# EasyEDA Pro project STM32_sniffer.eprj

# Schematic sniffer

## Sheets
1 MCU: Board Name: sniffer; Create Date: 2025-06-11; Page Name: MCU; Project Name: STM32_sniffer; Schematic Name: sniffer; Update Date: 2025-07-09; Company: 嘉立创EDA; Page Size: A4; Version: V1.0
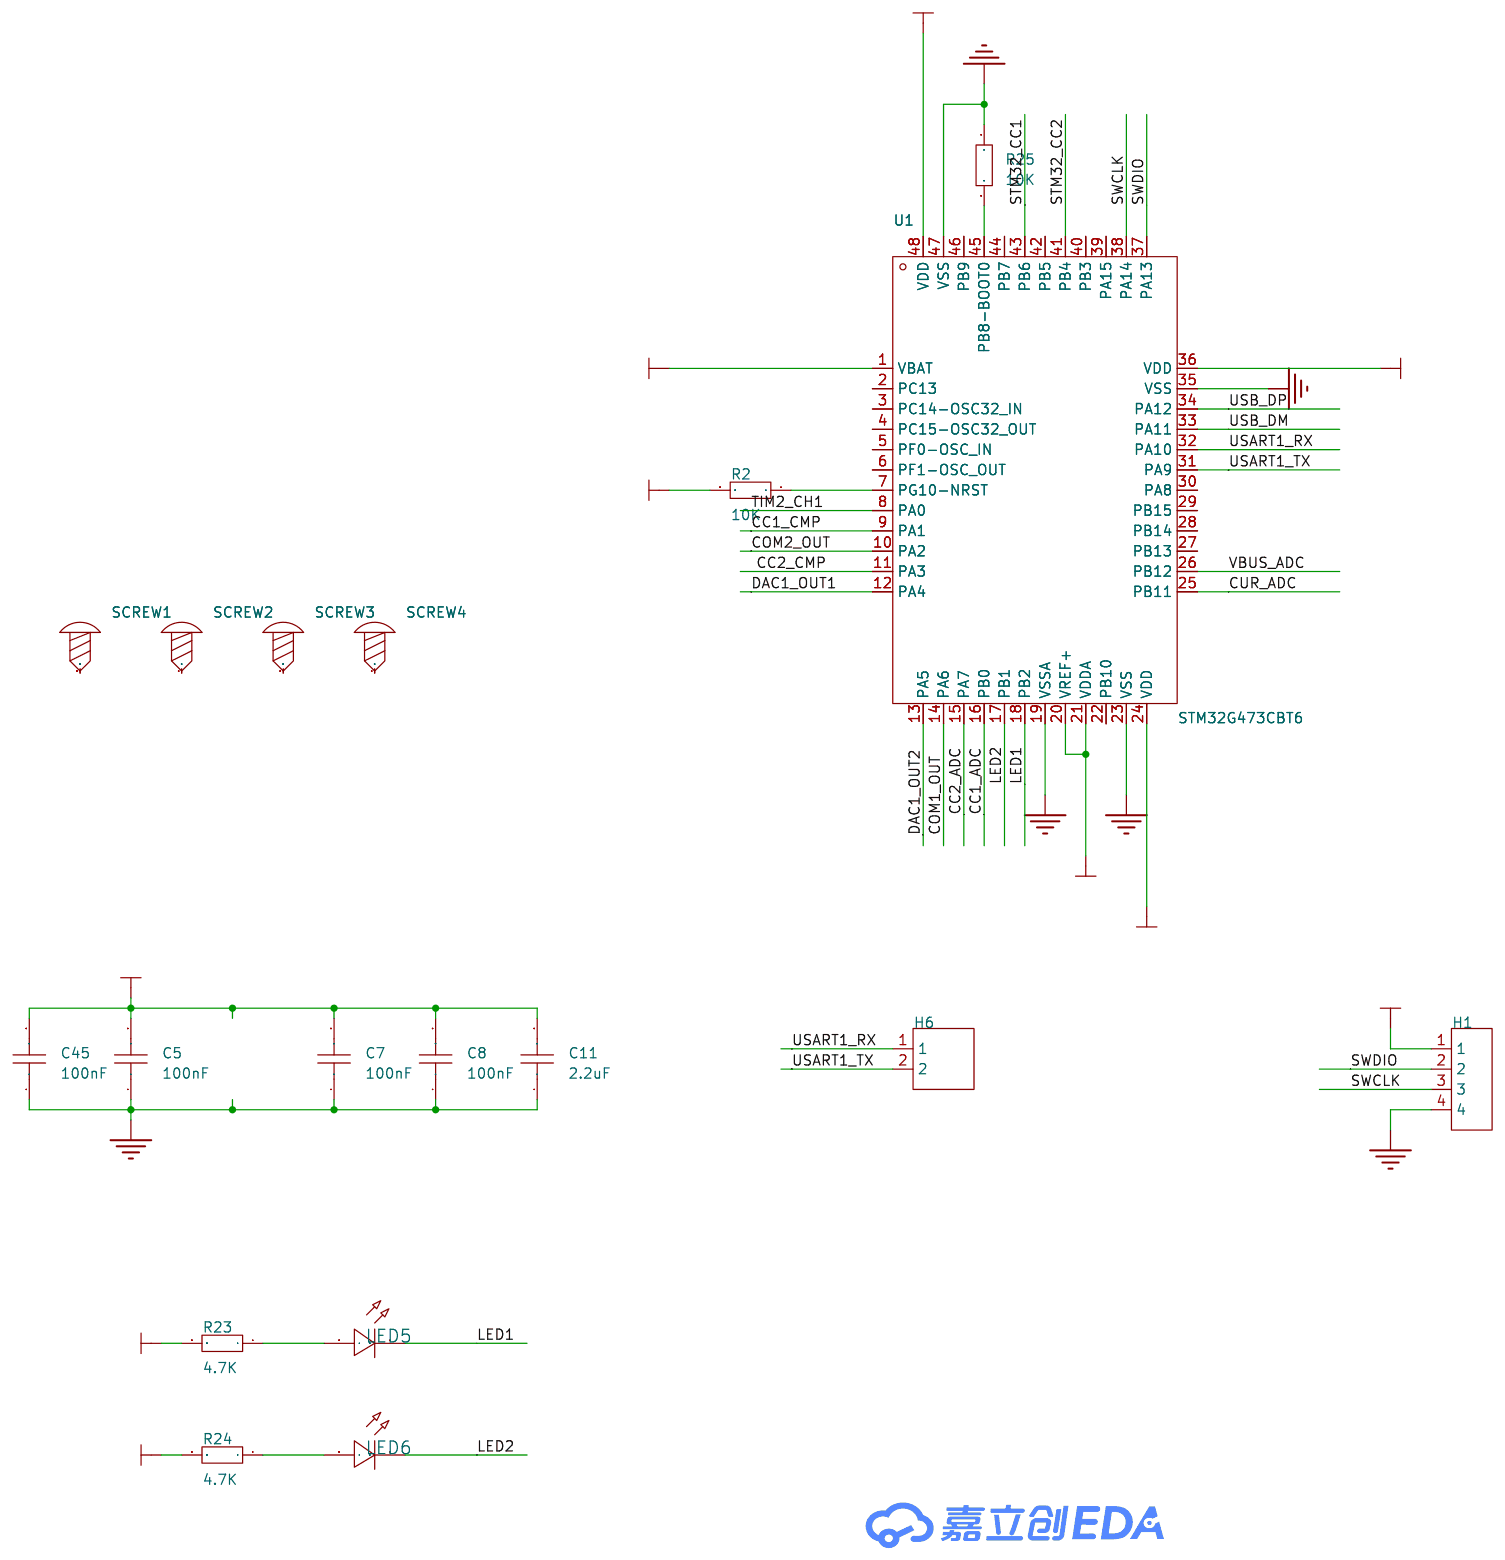
[diagram p0: MCU]
2 power: Page Name: power; Update Date: 2025-06-11
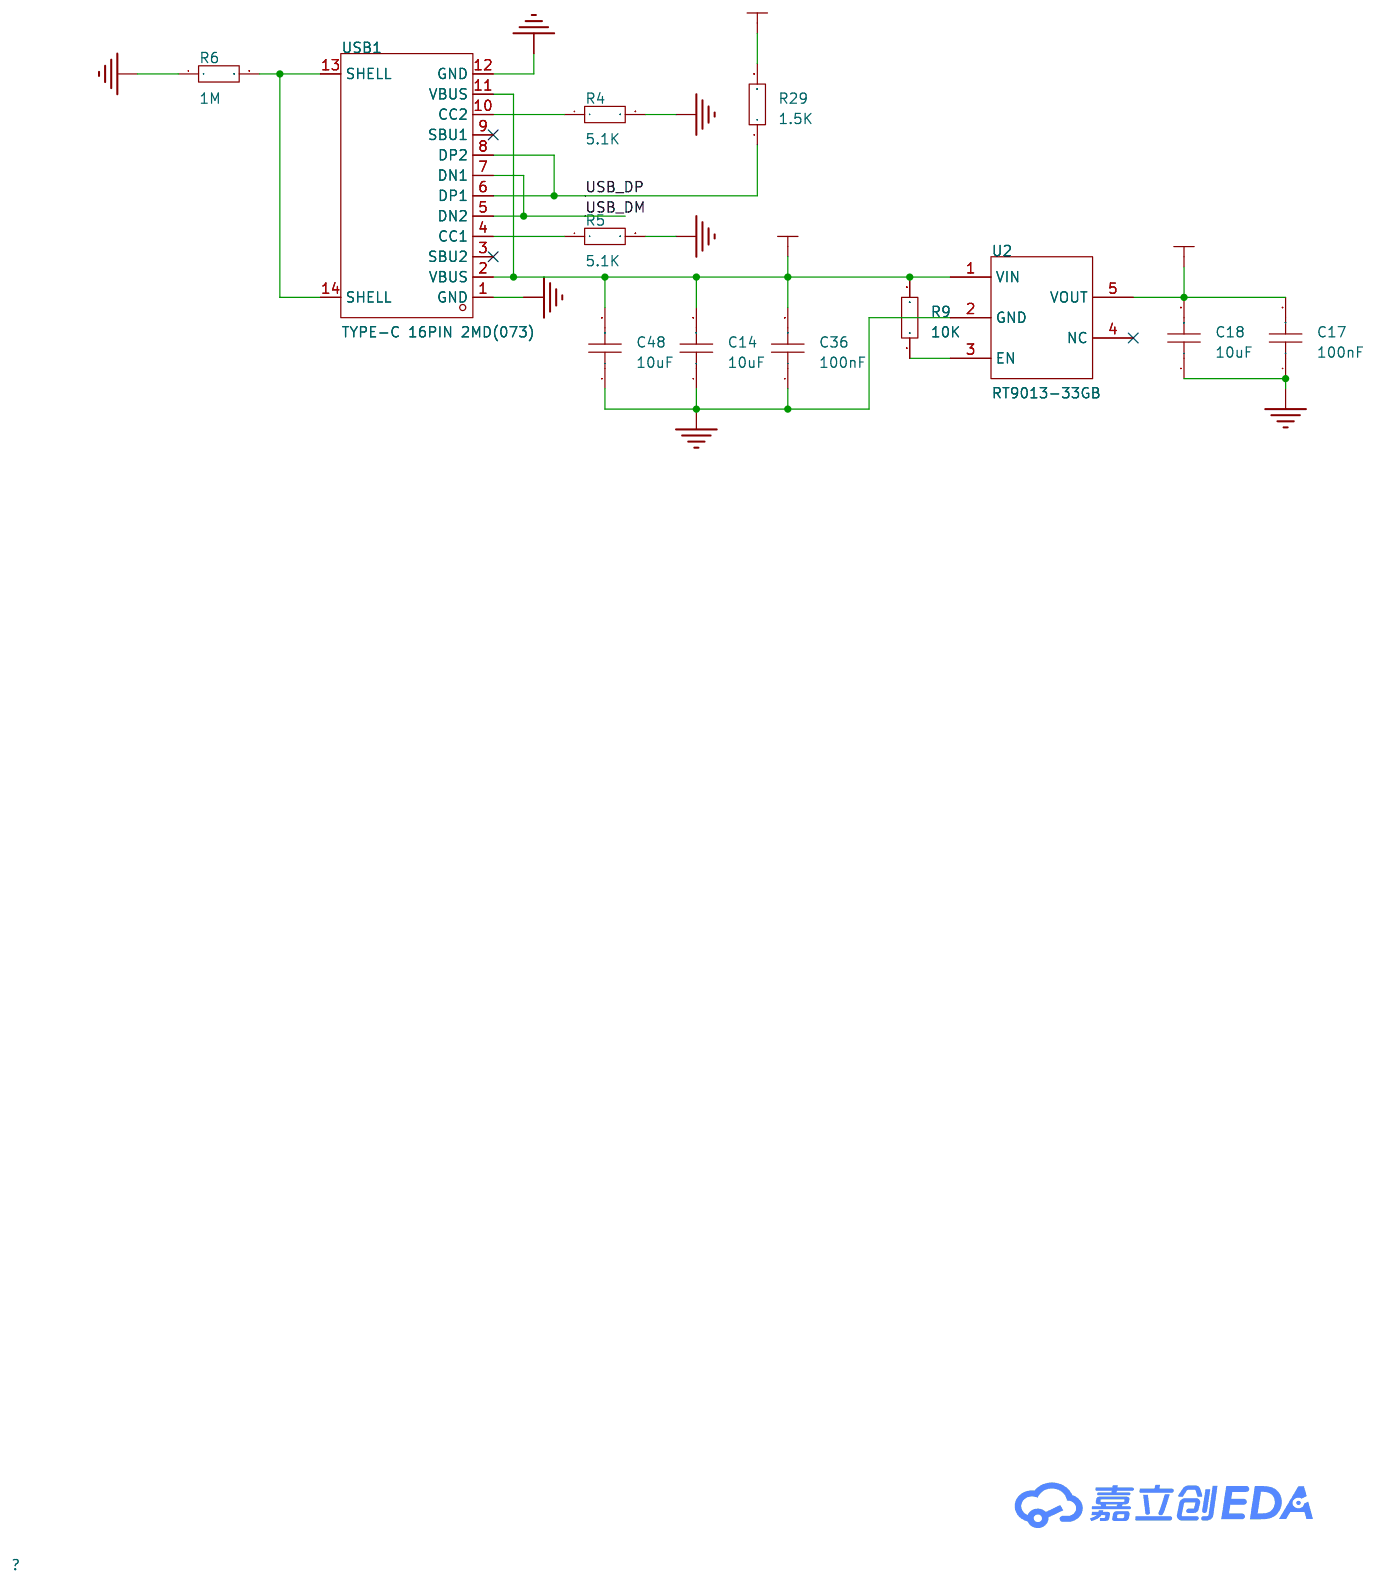
[diagram p1: power]
3 comp: Page Name: comp; Update Date: 2025-07-02
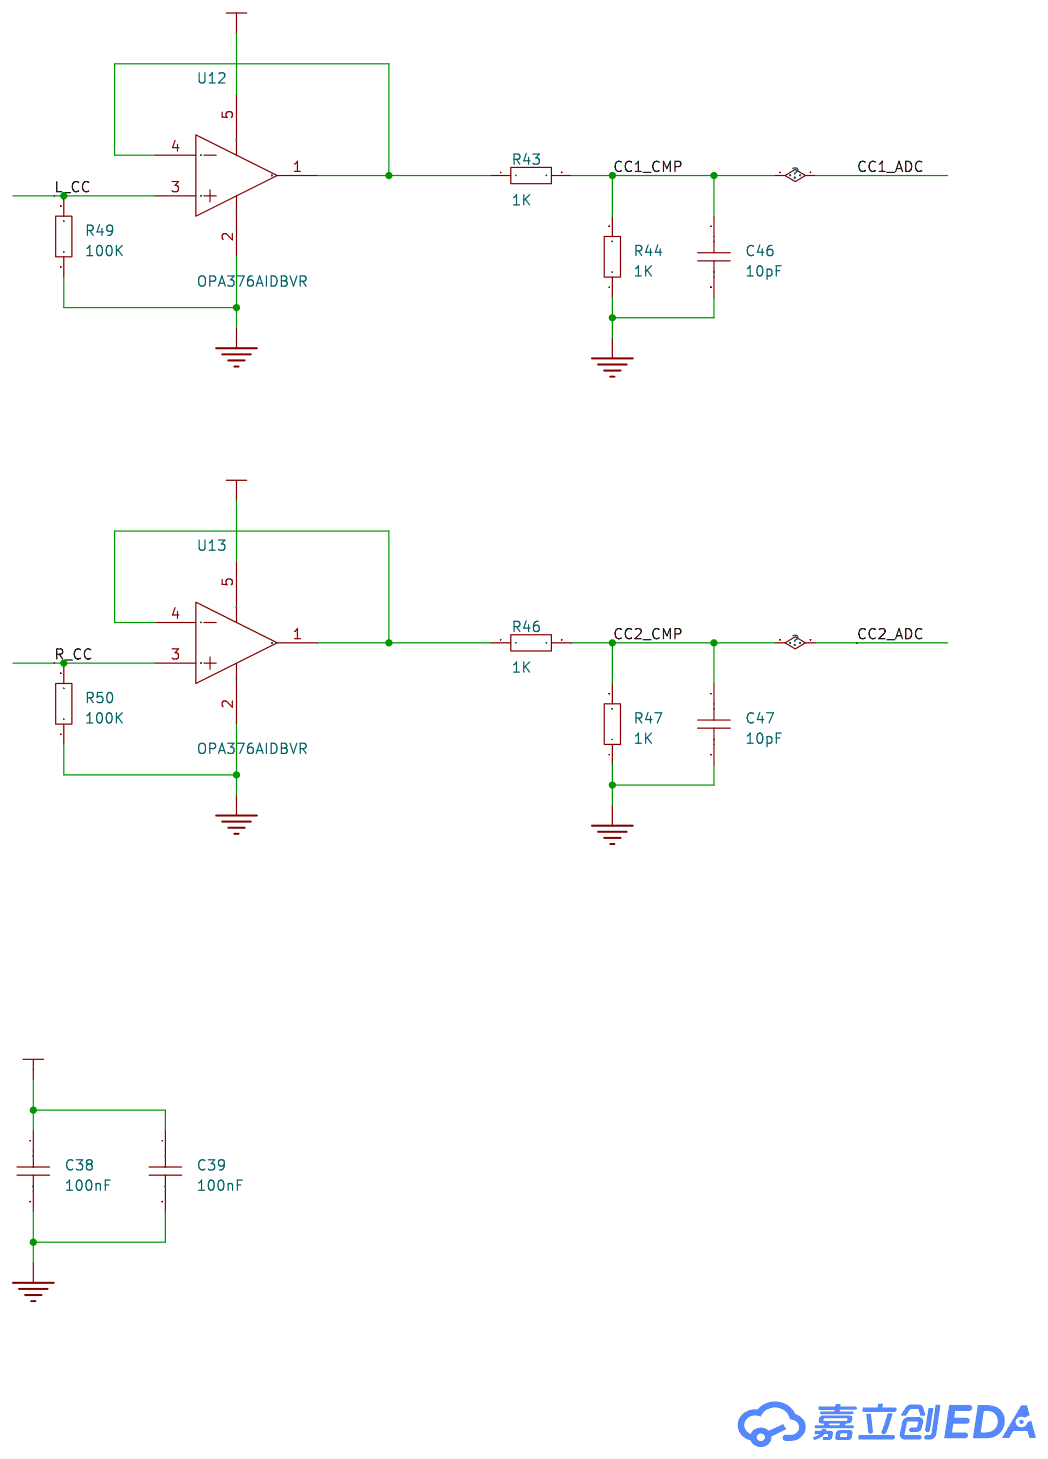
[diagram p2: comp]
4 typec: Page Name: typec
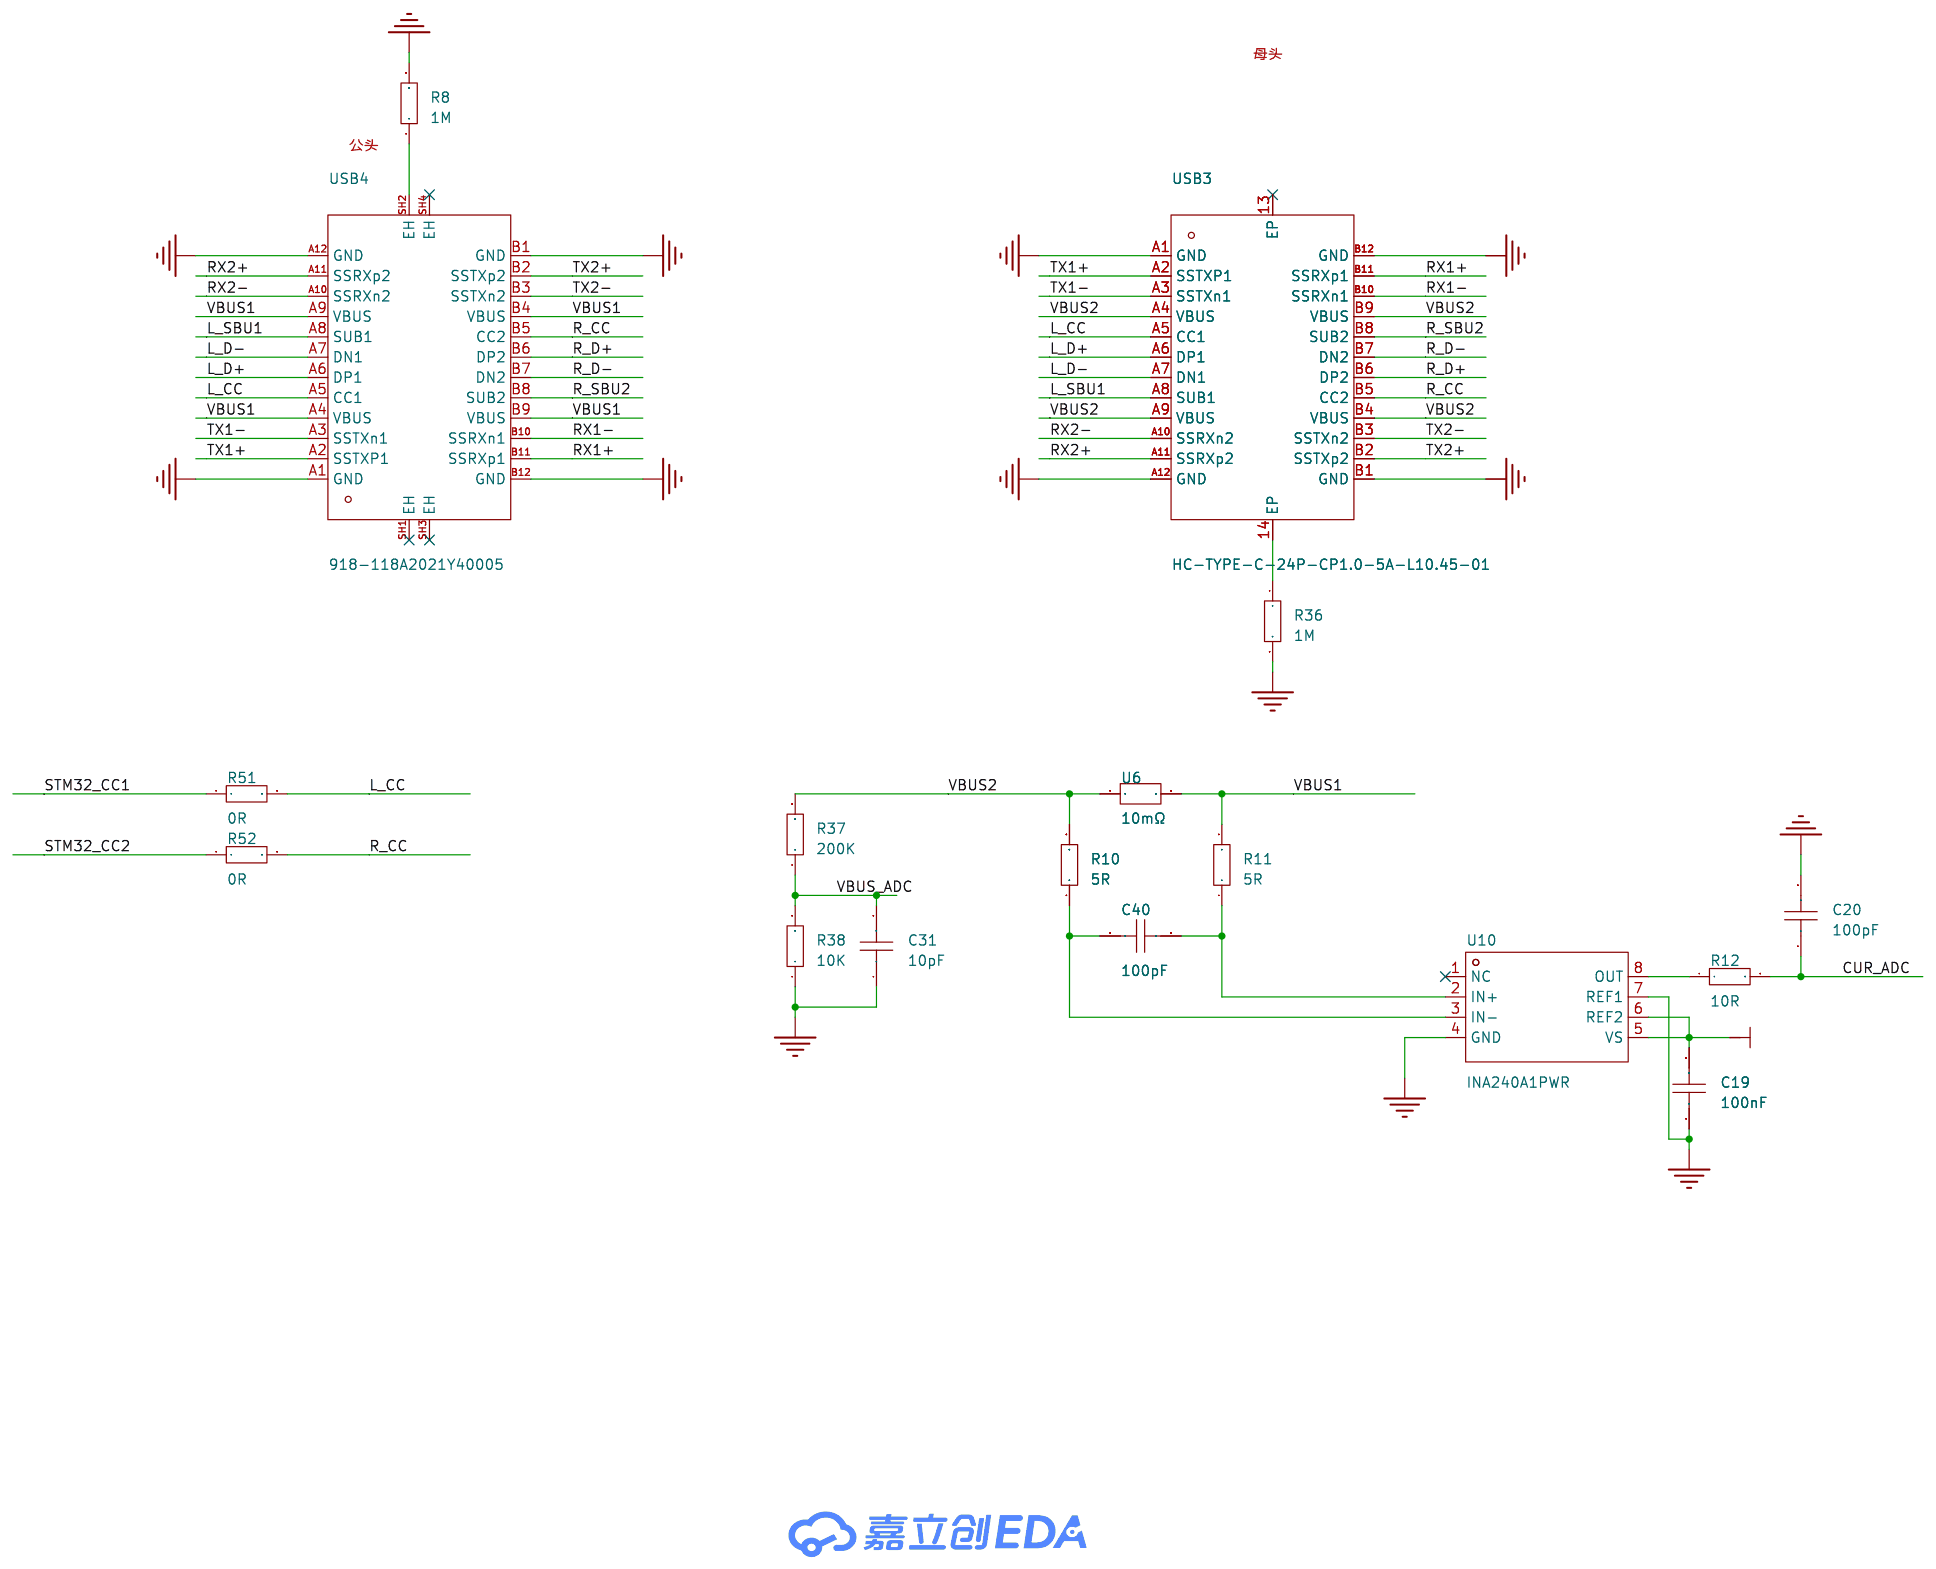
[diagram p3: typec]

## Parts
sheet comp
C38  100nF  [C0603]
C39  100nF  [C0603]
C46  10pF  [C0603]
C47  10pF  [C0603]
R43  1K  [R0603]
R44  1K  [R0603]
R46  1K  [R0603]
R47  1K  [R0603]
R49  100K  [R0603]
R50  100K  [R0603]
U12  OPA376AIDBVR  [SOT-23-5_L3.0-W1.7-P0.95-LS2.8-BR]
U13  OPA376AIDBVR  [SOT-23-5_L3.0-W1.7-P0.95-LS2.8-BR]
sheet MCU
C5  100nF  [C0603]
C7  100nF  [C0603]
C8  100nF  [C0603]
C11  2.2uF  [C0603]
C45  100nF  [C0603]
H1  -  [HDR-TH_4P-P2.54-V-M]
H6  -  [HDR-TH_2P-P2.54-V-M-1]
LED5  -  [LED_0805]
LED6  -  [LED_0805]
R2  10K  [R0603]
R23  4.7K  [R0603]
R24  4.7K  [R0603]
R25  10K  [R0603]
SCREW1  -  [M2螺丝]
SCREW2  -  [M2螺丝]
SCREW3  -  [M2螺丝]
SCREW4  -  [M2螺丝]
U1  STM32G473CBT6  [LQFP-48_L7.0-W7.0-P0.50-LS9.0-BL]
sheet power
C14  10uF  [C0805]
C17  100nF  [C0603]
C18  10uF  [C0603]
C36  100nF  [C0805]
C48  10uF  [C0805]
R4  5.1K  [R0603]
R5  5.1K  [R0603]
R6  1M  [R0603]
R9  10K  [R0603]
R29  1.5K  [R0603]
U2  RT9013-33GB  [SOT-23-5_L3.0-W1.7-P0.95-LS2.8-BL]
USB1  TYPE-C 16PIN 2MD(073)  [USB-C-SMD_TYPE-C-6PIN-2MD-073]
sheet typec
C19  100nF  [C0603]
C20  100pF  [C0603]
C31  10pF  [C0603]
C40  100pF  [C0603]
R8  1M  [R0603]
R10  5R  [R0603]
R11  5R  [R0603]
R12  10R  [R0603]
R36  1M  [R0603]
R37  200K  [R0603]
R38  10K  [R0603]
R51  0R  [R0603]
R52  0R  [R0603]
U6  10mΩ  [R1206]
U10  INA240A1PWR  [TSSOP-8_L4.4-W3.0-P0.65-LS6.4-BL]
USB3  HC-TYPE-C-24P-CP1.0-5A-L10.45-01  [USB-SMD_HC-TYPE-C-24P-CP1.0-5A-L10.45-01]
USB4  918-118A2021Y40005  [USB-C-SMD_918-118A2021Y40005]

## Library data of the parts
C5 C7 C8 C11 C17-C20 C31 C38-C40 C45-C47 = CAP_0603: Supplier Footprint: 0603
R2 R4-R6 R8-R12 R23-R25 R29 R36-R38 R43 R44 R46 R47 R49-R52 = Res_0603: Supplier Footprint: 0603
U12 U13 = OPA376AIDBVR: Supplier Part: C42134; Manufacturer: TI(德州仪器); Supplier Footprint: SOT-23-5; JLCPCB Part Class: 扩展库; Datasheet: https://www.ti.com/cn/lit/gpn/opa376; Supplier: LCSC; Number of Circuits: 单路; Gain Bandwidth Product(GBP): 5.5MHz; Current - Input Bias(Ib): 0.2pA; Slew Rate(SR): 2V/us; Output Current: 50mA; Supply Current: 760uA; Operating Temperature: -40℃~+125℃
H1 = HDR-M_2.54_1x4P: Supplier Part: C492403; Supplier Footprint: 插件
H6 = HDR-M_2.54_1x2P: Supplier Part: C124375; Supplier Footprint: 插件
LED5 LED6 = LED_0805-R: Supplier Footprint: 0805
SCREW1-SCREW4 = M2螺丝: Supplier Footprint: 插件
U1 = STM32G473CBT6: LCSC Part Name: 带DSP和FPU的170MHz主流ARM Cortex-M4 MCU，具有128 KB Flash存储器、数学加速器和高模拟电平集成; Supplier Part: C730111; Manufacturer: ST(意法半导体); Supplier Footprint: LQFP-48(7x7); JLCPCB Part Class: 扩展库; Datasheet: https://atta.szlcsc.com/upload/public/pdf/source/20200902/C730111_19331807E2800E1C1C13BFFAAC550E20.pdf; Supplier: LCSC
C14 C36 C48 = CAP_0805: Supplier Footprint: 0805
U2 = RT9013-33GB: 输出类型:固定;最大输入电压:5.5V;输出电压:3.3V;输出电流:500mA;电源纹波抑制比(PSRR):50dB@(10kHz);输出极性:正极;; LCSC Part Name: 输入5.5V 输出3.3V 500mA; Supplier Part: C47773; Manufacturer: RICHTEK(立锜); Supplier Footprint: SOT-23-5; JLCPCB Part Class: 扩展库; Datasheet: https://atta.szlcsc.com/upload/public/pdf/source/20150504/1457707282459.pdf; Supplier: LCSC; Output Type: 固定; Maximum Input Voltage: 5.5V; Output Voltage: 3.3V; Output Current: 500mA; Power Supply Rejection Ratio (PSRR): 50dB@(10kHz); Dropout Voltage: 400mV@(500mA); standby current: 50uA; Feature: 低ESR；防静电保护；热保护(TSD)；过流保护(OCP)；带使能; Operating Temperature: -40℃~+85℃; Output Polarity: 正极; Number of Outputs: 1
USB1 = TYPE-C 16PIN 2MD(073): 连接器类型:Type-C;标准:USB 3.1;公母:母;安装方式:卧贴;触点数量:16P;端口数量:1;额定电流 - 电源:5A;工作温度范围:-25℃~+85℃;; LCSC Part Name: Type-C 母 卧贴; Supplier Part: C2765186; Manufacturer: SHOU HAN(首韩); Supplier Footprint: SMD; JLCPCB Part Class: 扩展库; Datasheet: https://atta.szlcsc.com/upload/public/pdf/source/20211123/39B17C16241EAC15C5E277BDA434118E.pdf; Supplier: LCSC; Connector Type: Type-C; Standard: USB 3.1; Gender: 母; Mounting Style: 卧贴; Number of Contacts: 16P; Number of Ports: 1; Current Rating - Power (Max): 5A; Operating Temperature Range: -25℃~+85℃; Rated Voltage (Max): 5V; Connect-Disconnect Life: 5千次; Core Colour: 黑色
U6 = FRM121WFR010TM: 电阻类型:采样电阻;阻值:10mΩ;精度:±1%;额定压降:-;功率:1W;温度系数:±50ppm/℃;安装方式:-;; LCSC Part Name: 10mΩ ±1% 1W; Supplier Part: C7467248; Manufacturer: FOJAN(富捷); Supplier Footprint: 1206; JLCPCB Part Class: 扩展库; Datasheet: https://atta.szlcsc.com/upload/public/pdf/source/20240709/7FCE84187288C94C67B1004F90EDDF14.pdf; Supplier: LCSC; Type: 采样电阻; Tolerance: ±1%; Power(Watts): 1W; Temperature Coefficient: ±50ppm/℃
U10 = INA240A1PWR: 放大器数:单路;; Supplier Part: C93965; Manufacturer: TI(德州仪器); Supplier Footprint: TSSOP-8; JLCPCB Part Class: 扩展库; Datasheet: https://www.ti.com/cn/lit/gpn/ina240; Supplier: LCSC; Number of Channels: 单路; Supply Current: 1.8mA; Operating Temperature: -40℃~+125℃
USB3 = HC-TYPE-C-24P-CP1.0-5A-L10.45-01: LCSC Part Name: Type-C 母 夹板; Supplier Part: C5345940; Manufacturer: HCTL(华灿天禄); Supplier Footprint: SMD; JLCPCB Part Class: 扩展库; Datasheet: https://atta.szlcsc.com/upload/public/pdf/source/20230104/90199ECB4DA43580F17C1059E2FCE2F9.pdf; Supplier: LCSC; Connector Type: Type-C; Standard: USB 3.1; Gender: 母; Number of Ports: 1; Number of Contacts: 24P; Mounting Style: 夹板; Current Rating - Power (Max): 5A; Contact Material: 高导铜; Contact Plating: 金; Operating Temperature Range: -30℃~+85℃; Soldering Temperature(Max): 260℃
USB4 = 918-118A2021Y40005: LCSC Part Name: Type-C 公 夹板; Supplier Part: C2763098; Manufacturer: 精拓金; Supplier Footprint: SMD; JLCPCB Part Class: 扩展库; Datasheet: https://atta.szlcsc.com/upload/public/pdf/source/20210526/C2763098_0462DF80D8E0D38B733643D2DF6AAD68.pdf; Supplier: LCSC; Connector Type: Type-C; Protocol Standard: USB 3.1; Gender: 公; Mounting Type: 夹板; Number of Contacts: 24P; Number of Ports: 1

## Nets
GND: C5.1 C7.1 C8.1 C11.1 C14.1 C17.1 C18.1 C19.1 C20.2 C31.1 C36.1 C38.2 C39.2 C45.1 C46.2 C47.2 C48.1 H1.4 R4.2 R5.2 R6.1 R8.2 R25.1 R36.2 R38.1 R44.1 R47.1 R49.1 R50.1 U1.19(VSSA) U1.23(VSS) U1.35(VSS) U1.47(VSS) U2.2(GND) U10.4(GND) U10.7(REF1) U12.2(V-) U13.2(V-) USB1.1(GND) USB1.12(GND) USB3.A1(GND) USB3.A12(GND) USB3.B1(GND) USB3.B12(GND) USB4.A1(GND) USB4.A12(GND) USB4.B1(GND) USB4.B12(GND)
VBUS1: R11.2 U6.2 USB4.A4(VBUS) USB4.A9(VBUS) USB4.B4(VBUS) USB4.B9(VBUS)
VBUS2: R10.2 R37.2 U6.1 USB3.A4(VBUS) USB3.A9(VBUS) USB3.B4(VBUS) USB3.B9(VBUS)
VBUS_ADC: C31.2 R37.1 R38.2 U1.26(PB12)
VCC_3V3: C5.2 C7.2 C8.2 C11.2 C17.2 C18.2 C19.2 C45.2 H1.1 R2.2 R23.2 R24.2 R29.2 U1.1(VBAT) U1.20(VREF+) U1.21(VDDA) U1.24(VDD) U1.36(VDD) U1.48(VDD) U2.5(VOUT) U10.5(VS) U10.6(REF2)
VCC_5V: C14.2 C36.2 C38.1 C39.1 C48.2 R9.2 U2.1(VIN) U12.5(V+) U13.5(V+) USB1.2(VBUS) USB1.11(VBUS)
CC1_ADC: C46.1 R43.2 R44.2 U1.9(PA1) U1.16(PB0)
CC2_ADC: C47.1 R46.2 R47.2 U1.11(PA3) U1.15(PA7)
COM1_OUT: U1.14(PA6)
COM2_OUT: U1.10(PA2)
CUR_ADC: C20.1 R12.2 U1.25(PB11)
DAC1_OUT1: U1.12(PA4)
DAC1_OUT2: U1.13(PA5)
L_CC: R49.2 R51.2 U12.3(IN+) USB3.A5(CC1) USB4.A5(CC1)
L_D+: USB3.A6(DP1) USB4.A6(DP1)
L_D-: USB3.A7(DN1) USB4.A7(DN1)
L_SBU1: USB3.A8(SUB1) USB4.A8(SUB1)
LED1: LED5.1(C) U1.18(PB2)
LED2: LED6.1(C) U1.17(PB1)
R_CC: R50.2 R52.2 U13.3(IN+) USB3.B5(CC2) USB4.B5(CC2)
R_D+: USB3.B6(DP2) USB4.B6(DP2)
R_D-: USB3.B7(DN2) USB4.B7(DN2)
R_SBU2: USB3.B8(SUB2) USB4.B8(SUB2)
RX1+: USB3.B11(SSRXp1) USB4.B11(SSRXp1)
RX1-: USB3.B10(SSRXn1) USB4.B10(SSRXn1)
RX2+: USB3.A11(SSRXp2) USB4.A11(SSRXp2)
RX2-: USB3.A10(SSRXn2) USB4.A10(SSRXn2)
STM32_CC1: R51.1 U1.43(PB6)
STM32_CC2: R52.1 U1.41(PB4)
SWCLK: H1.3 U1.38(PA14)
SWDIO: H1.2 U1.37(PA13)
TIM2_CH1: U1.8(PA0)
TX1+: USB3.A2(SSTXP1) USB4.A2(SSTXP1)
TX1-: USB3.A3(SSTXn1) USB4.A3(SSTXn1)
TX2+: USB3.B2(SSTXp2) USB4.B2(SSTXp2)
TX2-: USB3.B3(SSTXn2) USB4.B3(SSTXn2)
USART1_RX: H6.1 U1.32(PA10)
USART1_TX: H6.2 U1.31(PA9)
USB_DM: U1.33(PA11) USB1.5(DN2) USB1.7(DN1)
USB_DP: R29.1 U1.34(PA12) USB1.6(DP1) USB1.8(DP2)
$1N621: LED5.2(A) R23.1
$1N623: LED6.2(A) R24.1
$1N1122: R2.1 U1.7(PG10-NRST)
$1N1189: R25.2 U1.45(PB8-BOOT0)
$2N599: R4.1 USB1.10(CC2)
$2N601: R6.2 USB1.13(SHELL) USB1.14(SHELL)
$2N604: R5.1 USB1.4(CC1)
$2N606: R9.1 U2.3(EN)
$3N2025: R43.1 U12.1(OUT) U12.4(IN-)
$3N2420: R46.1 U13.1(OUT) U13.4(IN-)
$5N959: C40.1 R10.1 U10.3(IN-)
$5N960: C40.2 R11.1 U10.2(IN+)
$5N966: R12.1 U10.8(OUT)
$5N3365: R8.1 USB4.SH2(EH)
$5N3410: R36.1 USB3.14(EP)

Not connected (* = marked no-connect by the designer): SCREW1 1; SCREW2 1; SCREW3 1; SCREW4 1; U1 2(PC13) 3(PC14-OSC32_IN) 4(PC15-OSC32_OUT) 5(PF0-OSC_IN) 6(PF1-OSC_OUT) 22(PB10) 27(PB13) 28(PB14) 29(PB15) 30(PA8) 39(PA15) 40(PB3) 42(PB5) 44(PB7) 46(PB9); U2 4(NC)*; U10 1(NC)*; USB1 3(SBU2)* 9(SBU1)*; USB3 13(EP)*; USB4 SH1(EH)* SH3(EH)* SH4(EH)*

## Notes on the sheets
sheet 4
- 母头
- 公头

# Board PCB1
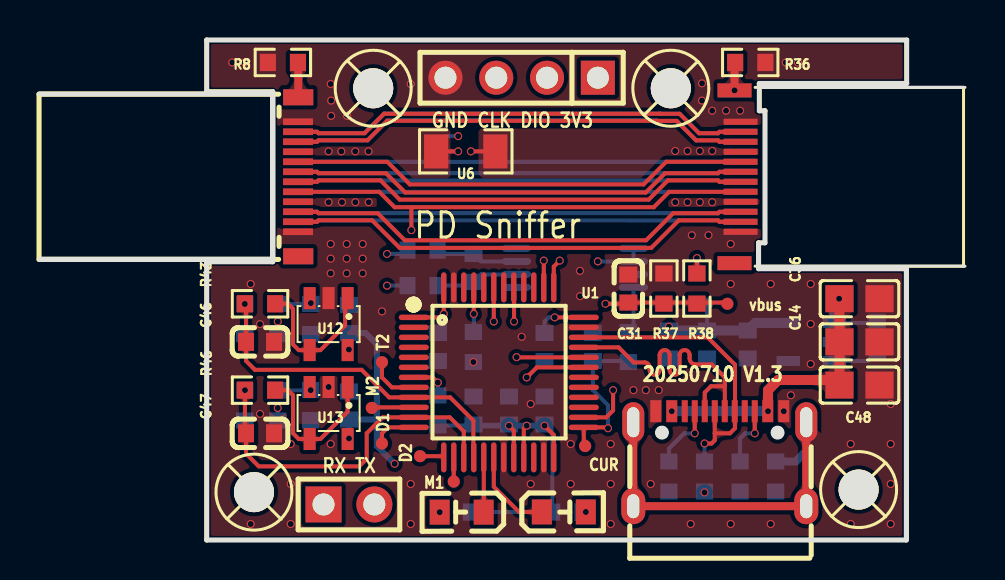
[diagram p4: board, top side]
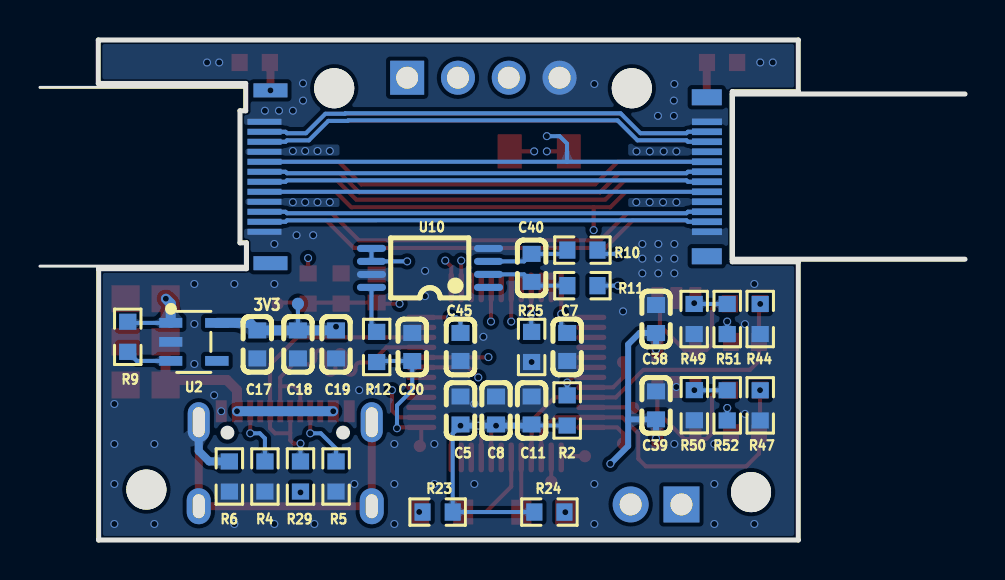
[diagram p5: board, bottom side, seen from below]

Outline 46.25 x 25 mm; copper layers: Top Layer, GND, Inner2, Bottom Layer. Coordinates in mm from the lower left corner of the outline.
Outline path: 8.33,25 8.33,22.42 11.64,22.42 11.64,13.91 8.33,13.91 8.33,0 43.32,0 43.32,13.56 35.93,13.56 35.93,14.86 36.25,14.86 36.25,21.46 35.97,21.46 35.97,22.83 43.33,22.83 43.33,25 8.33,25
Stack: Top Layer 0.035mm 外层铜厚1oz / Dielectric1 0.2104mm 7628 RC49% 8.6mil / GND 0.0152mm 内层铜厚 / Dielectric2 1.065mm 1.1mm H/HOZ Copper / Inner2 0.0152mm 内层铜厚 / Dielectric3 0.2104mm 7628 RC49% 8.6mil / Bottom Layer 0.035mm 外层铜厚1oz

## Design rules (mm)
net USB_DP: DP7
net USB_DM: DP7
net RX1+: DP3
net RX1-: DP3
net R_D-: DP6
net R_D+: DP6
net TX2-: DP4
net TX2+: DP4
net TX1+: DP2
net TX1-: DP2
net L_D+: DP5
net L_D-: DP5
net RX2-: DP1
net RX2+: DP1
template: 自定义配置
spacing copperThickness1oz (default): track to track 0.102, other pairs 0.152 to 0.3
spacing copperThickness2oz: track to track 0.203, other pairs 0.152 to 0.3
track width copperThickness1oz (default): min 0.127, default 0.203, max 2.54
track width copperThickness2oz: min 0.203, default 0.203, max 2.54
differential pair differentialPair (default): width min 0.127, default 0.203, max 2.54; gap min 0.152, default 0.152
via viaSize (default): diameter min 0.4, default 0.4, max 10; hole min 0.3, default 0.3, max 6.299

## Placement (name value [footprint] x y rotation side)
C5  100nF  [C0603]  25.23 6.48 270 bottom
C7  100nF  [C0603]  19.89 9.65 90 bottom
C8  100nF  [C0603]  23.45 6.48 270 bottom
C11  2.2uF  [C0603]  21.67 6.48 270 bottom
C14  10uF  [C0805]  40.97 9.91 180 top
C17  100nF  [C0603]  35.39 9.78 90 bottom
C18  10uF  [C0603]  33.35 9.78 90 bottom
C19  100nF  [C0603]  31.45 9.78 90 bottom
C20  100pF  [C0603]  27.64 9.65 90 bottom
C31  10pF  [C0603]  29.42 12.57 270 top
C36  100nF  [C0805]  40.97 12.06 180 top
C38  100nF  [C0603]  15.45 11.05 90 bottom
C39  100nF  [C0603]  15.45 6.73 90 bottom
C40  100pF  [C0603]  21.67 13.61 270 bottom
C45  100nF  [C0603]  25.23 9.65 90 bottom
C46  10pF  [C0603]  11 9.91 0 top
C47  10pF  [C0603]  11 5.33 0 top
C48  10uF  [C0805]  40.97 7.75 180 top
H1  -  [HDR-TH_4P-P2.54-V-M]  24.08 23.11 180 top
H6  -  [HDR-TH_2P-P2.54-V-M-1]  15.45 1.78 0 top
LED5  -  [LED_0805]  26.24 1.4 0 top
LED6  -  [LED_0805]  21.03 1.4 180 top
NOREF  -  [Pad_e97]  16.59 6.6 0 top
NOREF#2  -  [Pad_e421]  17.1 8.89 0 top
NOREF#3  -  [Pad_e100]  20.69 2.92 0 top
NOREF#4  -  [Pad_e3002]  27.26 4.7 180 top
NOREF#5  -  [Pad_e432]  17.1 4.83 0 top
NOREF#6  -  [Pad_e3028]  34.37 11.81 0 top
NOREF#7  -  [Pad_e433]  19 4.19 0 top
NOREF#8  -  [Pad_e3074]  33.35 11.81 0 top
R2  10K  [R0603]  19.89 6.48 270 bottom
R4  5.1K  [R0603]  35 3.17 270 bottom
R5  5.1K  [R0603]  31.45 3.17 270 bottom
R6  1M  [R0603]  36.78 3.17 90 bottom
R8  1M  [R0603]  12.14 23.88 180 top
R9  10K  [R0603]  41.86 10.16 90 bottom
R10  5R  [R0603]  19.13 14.5 180 bottom
R11  5R  [R0603]  19.13 12.72 180 bottom
R12  10R  [R0603]  29.42 9.65 270 bottom
R23  4.7K  [R0603]  26.37 1.4 180 bottom
R24  4.7K  [R0603]  20.78 1.4 0 bottom
R25  10K  [R0603]  21.67 9.65 90 bottom
R29  1.5K  [R0603]  33.23 3.17 270 bottom
R36  1M  [R0603]  35.51 23.88 0 top
R37  200K  [R0603]  32.85 12.57 90 top
R38  10K  [R0603]  31.2 12.57 270 top
R43  1K  [R0603]  11 11.81 180 top
R44  1K  [R0603]  10.24 11.05 90 bottom
R46  1K  [R0603]  11 7.49 180 top
R47  1K  [R0603]  10.24 6.73 90 bottom
R49  100K  [R0603]  13.54 11.05 90 bottom
R50  100K  [R0603]  13.53 6.74 90 bottom
R51  0R  [R0603]  11.89 11.05 90 bottom
R52  0R  [R0603]  11.89 6.73 90 bottom
SCREW1  -  [M2螺丝]  16.66 22.59 0 top
SCREW2  -  [M2螺丝]  10.7 2.39 0 top
SCREW3  -  [M2螺丝]  40.93 2.52 0 top
SCREW4  -  [M2螺丝]  31.54 22.59 0 top
U1  STM32G473CBT6  [LQFP-48_L7.0-W7.0-P0.50-LS9.0-BL]  22.94 8.38 270 top
U2  RT9013-33GB  [SOT-23-5_L3.0-W1.7-P0.95-LS2.8-BL]  38.56 9.91 270 bottom
U6  10mΩ  [R1206]  21.29 19.43 180 top
U10  INA240A1PWR  [TSSOP-8_L4.4-W3.0-P0.65-LS6.4-BL]  26.75 13.61 90 bottom
U12  OPA376AIDBVR  [SOT-23-5_L3.0-W1.7-P0.95-LS2.8-BR]  14.43 10.8 90 top
U13  OPA376AIDBVR  [SOT-23-5_L3.0-W1.7-P0.95-LS2.8-BR]  14.43 6.35 90 top
USB1  TYPE-C 16PIN 2MD(073)  [USB-C-SMD_TYPE-C-6PIN-2MD-073]  33.99 4.06 0 top
USB3  HC-TYPE-C-24P-CP1.0-5A-L10.45-01  [USB-SMD_HC-TYPE-C-24P-CP1.0-5A-L10.45-01]  34.88 18.16 90 top
USB4  918-118A2021Y40005  [USB-C-SMD_918-118A2021Y40005]  12.91 18.16 270 top

## Footprints (pads in the part's own frame, mm; a bottom-side part is the same pattern mirrored in y, then rotated)
C0603
  rect 0.8x0.9 smd: 1(-0.7,0) 2(0.7,0)
C0805
  rect 1.41x1.35 smd: 1(-1,0) 2(1,0)
HDR-TH_2P-P2.54-V-M-1
  rect 1.8x1.8 hole 1.1: 1(-1.27,0)
  round 1.8 hole 1.1: 2(1.27,0)
HDR-TH_4P-P2.54-V-M
  rect 1.7x1.7 hole 1.1: 1(-3.81,0)
  round 1.7 hole 1.1: 2(-1.27,0) 3(1.27,0) 4(3.81,0)
LED_0805
  rect 1x1.25 smd: 1(-1.15,0.005) 2(1.05,0.005)
LQFP-48_L7.0-W7.0-P0.50-LS9.0-BL
  oval 0.27x1.5 smd: 1(-2.75,-4.25) 2(-2.25,-4.25) 3(-1.75,-4.25) 4(-1.25,-4.25) 5(-0.75,-4.25) 6(-0.25,-4.25) 7(0.25,-4.25) 8(0.75,-4.25) 9(1.25,-4.25) 10(1.75,-4.25) 11(2.25,-4.25) 12(2.75,-4.25) 25(2.75,4.25) 26(2.25,4.25) 27(1.75,4.25) 28(1.25,4.25) 29(0.75,4.25) 30(0.25,4.25) 31(-0.25,4.25) 32(-0.75,4.25) 33(-1.25,4.25) 34(-1.75,4.25) 35(-2.25,4.25) 36(-2.75,4.25)
  oval 1.5x0.27 smd: 13(4.25,-2.75) 14(4.25,-2.25) 15(4.25,-1.75) 16(4.25,-1.25) 17(4.25,-0.75) 18(4.25,-0.25) 19(4.25,0.25) 20(4.25,0.75) 21(4.25,1.25) 22(4.25,1.75) 23(4.25,2.25) 24(4.25,2.75) 37(-4.25,2.75) 38(-4.25,2.25) 39(-4.25,1.75) 40(-4.25,1.25) 41(-4.25,0.75) 42(-4.25,0.25) 43(-4.25,-0.25) 44(-4.25,-0.75) 45(-4.25,-1.25) 46(-4.25,-1.75) 47(-4.25,-2.25) 48(-4.25,-2.75)
M2螺丝
  round 2 hole 2: 1(0,0)
Pad_e97
  round 0.61 smd: TP1(0,0)
Pad_e100
  round 0.61 smd: TP2(0,0)
Pad_e421
  round 0.61 smd: TP1(0,0)
Pad_e432
  round 0.61 smd: TP2(0,0)
Pad_e433
  round 0.61 smd: TP3(0,0)
Pad_e3002
  round 0.61 smd: TP3(0,0)
Pad_e3028
  round 0.61 smd: TP4(0,0)
Pad_e3074
  round 0.61 smd far side: TP5(0,0)
R0603
  rect 0.806x0.864 smd: 1(-0.753,0) 2(0.753,0)
R1206
  rect 1.208x1.701 smd: 1(-1.479,0) 2(1.479,0)
SOT-23-5_L3.0-W1.7-P0.95-LS2.8-BL
  rect 0.49x1.157 smd: 1(-0.95,-1.153) 2(0,-1.153) 3(0.95,-1.153)
  rect 0.49x1.175 smd: 4(0.95,1.153) 5(-0.95,1.153)
SOT-23-5_L3.0-W1.7-P0.95-LS2.8-BR
  rect 1.1x0.6 smd: 1(1.3,-0.95) 2(1.3,0) 3(1.3,0.95) 4(-1.3,0.95) 5(-1.3,-0.95)
TSSOP-8_L4.4-W3.0-P0.65-LS6.4-BL
  oval 0.353x1.454 smd: 1(-0.975,-2.927) 2(-0.325,-2.927) 3(0.325,-2.927) 4(0.975,-2.927) 5(0.975,2.927) 6(0.325,2.927) 7(-0.325,2.927) 8(-0.975,2.927)
USB-C-SMD_918-118A2021Y40005
  rect 0.33x1.5 smd: A1(2.75,-0.005) A2(2.249,-0.005) A3(1.749,-0.005) A4(1.249,-0.005) A5(0.751,-0.005) A6(0.251,-0.005) A7(-0.25,-0.005) A8(-0.75,-0.005) A9(-1.25,-0.005) A10(-1.751,-0.005) A11(-2.25,-0.005) A12(-2.749,-0.005)
  rect 0.33x1.5 smd far side: B1(-2.749,-0.005) B2(-2.25,-0.005) B3(-1.751,-0.005) B4(-1.25,-0.005) B5(-0.75,-0.005) B6(-0.25,-0.005) B7(0.251,-0.005) B8(0.751,-0.005) B9(1.249,-0.005) B10(1.749,-0.005) B11(2.249,-0.005) B12(2.75,-0.005)
  rect 0.8x1.5 smd: SH1(3.975,0.005) SH2(-3.975,0.005)
  rect 0.8x1.5 smd far side: SH3(-3.975,0.005) SH4(3.975,0.005)
USB-C-SMD_TYPE-C-6PIN-2MD-073
  rect 0.55x1.1 smd: 1(-3.2,2.375) 2(-2.4,2.375) 11(2.4,2.375) 12(3.2,2.375)
  rect 0.3x1.1 smd: 3(-1.75,2.375) 4(-1.25,2.375) 5(-0.75,2.375) 6(-0.25,2.375) 7(0.25,2.375) 8(0.75,2.375) 9(1.25,2.375) 10(1.75,2.375)
  oval 1.1x2 hole 0.6x1.5: 13(-4.325,1.825) 14(4.325,1.825)
  oval 1.2x1.8 hole 0.6x1.2: 13(-4.325,-2.375) 14(4.325,-2.375)
USB-SMD_HC-TYPE-C-24P-CP1.0-5A-L10.45-01
  rect 0.7x1.7 smd: 13(-4.32,0.15) 14(4.32,0.15)
  rect 0.7x1.7 smd far side: 13(-4.32,0.15) 14(4.32,0.15)
  rect 0.3x1.7 smd: A1(-2.75,-0.15) A2(-2.25,-0.15) A3(-1.75,-0.15) A4(-1.25,-0.15) A5(-0.75,-0.15) A6(-0.25,-0.15) A7(0.25,-0.15) A8(0.75,-0.15) A9(1.25,-0.15) A10(1.75,-0.15) A11(2.25,-0.15) A12(2.75,-0.15)
  rect 0.3x1.7 smd far side: B1(2.75,-0.15) B2(2.25,-0.15) B3(1.75,-0.15) B4(1.25,-0.15) B5(0.75,-0.15) B6(0.25,-0.15) B7(-0.25,-0.15) B8(-0.75,-0.15) B9(-1.25,-0.15) B10(-1.75,-0.15) B11(-2.25,-0.15) B12(-2.75,-0.15)

## Nets
As in the schematic, except:
VBUS_ADC: C31.2 NOREF#6.TP4 R37.1 R38.2 U1.26
VCC_3V3: C5.2 C7.2 C8.2 C11.2 C17.2 C18.2 C19.2 C45.2 H1.1 NOREF#8.TP5 R2.2 R23.2 R24.2 R29.2 U1.1 U1.20 U1.21 U1.24 U1.36 U1.48 U2.5 U10.5 U10.6
COM1_OUT: NOREF#3.TP2 U1.14
COM2_OUT: NOREF.TP1 U1.10
CUR_ADC: C20.1 NOREF#4.TP3 R12.2 U1.25
DAC1_OUT1: NOREF#5.TP2 U1.12
DAC1_OUT2: NOREF#7.TP3 U1.13
TIM2_CH1: NOREF#2.TP1 U1.8

Pads without a net: SCREW1 1; SCREW2 1; SCREW3 1; SCREW4 1; U1 2 3 4 5 6 22 27 28 29 30 39 40 42 44 46; U2 4; U10 1; USB1 3 9; USB3 13; USB4 SH1 SH3 SH4

## Via types
v1: diameter 0.4, hole 0.299, Top Layer to Bottom Layer, 126 vias
v2: diameter 0.4, hole 0.3, Top Layer to Bottom Layer, 3 vias

## Routing (per net, layer and track width the routed paths; a pad name or vN(x,y) marks a point on that pad's centre or on a via; arc(x,y) is an arc through that point)
GND:
  vias: v1(9.61,23.88) v1(10.24,23.88) v1(10.53,12.8) v1(10.53,0.8) v1(11,10.8) v1(11,6.31) v1(12.53,4.8) v1(12.53,2.8) v1(12.53,0.8) v1(14.43,7.65) v1(14.53,22.8) v1(14.56,21.97) v1(14.56,21.21) v1(14.53,14.8) v1(14.53,14.07) v1(14.53,13.33) v1(14.53,4.8) v1(15.35,21.21) v1(15.33,14.8) v1(15.33,14.07) v1(15.33,13.33) v1(16.13,14.8) v1(16.13,14.07) v1(16.13,13.33) v1(17.1,11.43) v1(18.53,22.8) v1(18.53,2.8) v1(18.53,0.8) v1(21.67,8.9) v1(24.08,10.16) v1(24.53,6.8) v1(24.53,2.8) v1(26.53,4.8) v1(26.53,2.8) v1(27,13.46) v1(27,12.19) v1(28.53,4.8) v1(28.53,2.8) v1(28.53,0.8) v1(29.67,7.49) v1(30.29,7.49) v1(30.53,2.8) v1(30.94,7.49) v1(32.53,0.8) v1(32.59,15.24) v1(33.1,22.83) v1(33.1,21.97) v1(33.42,15.24) v1(33.61,21.46) v1(34.3,21.46) v1(34.53,14.8) v1(34.53,12.8) v1(34.53,0.8) v1(35,21.46) v1(36.53,12.8) v1(36.53,0.8) v1(37.19,6.44) v1(37.29,23.88) v1(37.55,7.24) v1(37.9,23.88) v1(38.53,12.8) v1(38.53,10.8) v1(38.53,8.8) v1(40.53,4.8) v1(40.53,0.8) v1(42.53,6.8) v1(42.53,4.8) v1(42.53,2.8) v1(42.53,0.8)
VBUS1: length 13
  Top Layer w0.203: v1(20.91,19.43) U6.2
  Inner2 w0.203: v1(17.35,12.72) 16.95,12.72 16.59,13.08 16.59,14.61 16.97,14.99 20.15,14.99 20.91,15.75 v1(20.91,19.43)
  Bottom Layer w0.203: R11.2 v1(17.35,12.72)
  vias: v1(14.43,19.43) v1(14.43,16.89) v1(15.07,19.43) v1(15.1,16.89) v1(15.76,19.43) v1(15.77,16.89) v1(16.43,19.43) v1(16.44,16.89)
VBUS2: length 15
  Top Layer w0.203: R37.2 v1(32.85,14.1) ; v1(21.54,19.43) 22.77,19.43
  Inner2 w0.203: v1(32.85,14.1) 31.76,15.18 v1(31.76,16.89) ; v1(17.35,14.3) 20.35,14.3 21.54,15.49 v1(21.54,19.43)
  Bottom Layer w0.203: v1(17.35,14.3) 18.19,14.3 R10.2
  vias: v1(31.76,19.45) v1(32.38,19.45) v1(32.38,16.89) v1(32.99,19.45) v1(32.99,16.89) v1(33.61,19.45) v1(33.61,16.89)
VBUS_ADC: length 13.2
  Top Layer w0.203: U1.26 28.31,6.13 28.65,6.48 v1(28.65,7.49) ; v1(28.27,11.81) 29.36,11.81 C31.2 34.31,11.87 NOREF#6.TP4
  Inner2 w0.203: v1(28.27,11.81) 28.65,11.43 v1(28.65,7.49)
VCC_3V3: length 79.9
  Top Layer w0.203: U1.1 20.02,11.13 v1(20.19,11.3) U1.48 ; v1(25.23,5.72) 25.69,5.25 U1.24 ; U1.36 v1(25.73,11.13) ; v1(23.45,5.72) 23.69,5.47 U1.20 ; v1(24.34,5.72) 24.19,5.57 U1.21
  Inner2 w0.203: v1(27.89,13.93) 27.89,12.86 27.87,12.84 ; 25.23,11.11 25.25,11.13 v1(25.73,11.13) ; v1(31.45,10.67) 34.24,7.87 34.24,3.4 v1(33.23,2.38)
  Inner2 w0.3: v1(25.23,5.72) 25.23,12.84 25.22,12.84
  Inner2 w0.4: 31.45,12.84 21.73,12.84 v1(20.19,11.3) ; 31.45,12.84 v1(31.45,10.67) ; 31.45,12.84 31.45,14.35 27.89,17.91 H1.1
  Bottom Layer w0.203: v1(20.19,11.3) 20.19,10.65 C7.2 ; R2.2 21.62,5.72 C11.2 ; R24.2 R23.2 25.62,5.33 v1(25.23,5.72) ; U10.5 U10.6 v1(27.89,13.93) ; v1(25.73,11.13) 25.44,11.13 25.23,10.92 C45.2 ; C18.2 NOREF#8.TP5
  Bottom Layer w0.3: v1(25.23,5.72) v1(24.34,5.72) v1(23.45,5.72) 21.73,5.72 C11.2
  Bottom Layer w0.5: C19.2 C18.2 C17.2 35.76,10.86 U2.5
VCC_5V: length 46.1
  Top Layer w0.5: C36.2 C14.2 C48.2 39.72,8 36.91,8 36.4,7.49 v1(36.4,6.44)
  Inner2 w0.3: v1(31.59,6.44) 31.96,6.07 31.96,3.81 31.45,3.3 18.24,3.3 v1(17.73,3.81)
  Bottom Layer w0.203: R9.2 41.81,10.86 U2.1
  Bottom Layer w0.3: 16.84,6.02 16.83,6.03 15.45,6.03 15.45,6.03 v1(15.45,5.08) ; 16.84,6.02 16.84,9.78 16.27,10.35 C38.1 v1(15.45,9.53) ; 16.84,6.02 16.84,4.7 v1(17.73,3.81)
  Bottom Layer w0.5: v1(31.59,6.44) v1(36.4,6.44) ; v1(39.96,12.06) 39.71,11.82 U2.1
CC1_ADC: length 17.3
  Top Layer w0.203: R43.2 10.3,11.76 C46.1 10.3,8.95 10.75,8.51 16.08,8.51 17.46,7.13 U1.9 20.51,7.13 21.67,5.97 21.67,4.15 U1.16
  vias: v1(10.24,11.8)
CC2_ADC: length 17.7
  Top Layer w0.203: v1(10.25,7.49) 10.25,5.39 C47.1 10.3,4.32 10.94,3.68 15.95,3.68 16.34,4.06 16.34,5.33 17.13,6.13 U1.11 20.49,6.13 21.19,5.43 U1.15
COM1_OUT: length 1.2
  Top Layer w0.203: U1.14 NOREF#3.TP2
COM2_OUT: length 2.1
  Top Layer w0.203: U1.10 16.62,6.63 NOREF.TP1
CUR_ADC: length 7.7
  Top Layer w0.203: v1(28.4,5.59) 28.36,5.63 U1.25 27.19,4.77 NOREF#4.TP3
  Bottom Layer w0.203: R12.2 29.36,8.95 C20.1 27.64,7.49 28.4,6.73 v1(28.4,5.59)
DAC1_OUT1: length 2.2
  Top Layer w0.203: NOREF#5.TP2 17.1,5.33 17.4,5.63 U1.12
DAC1_OUT2: length 1.2
  Top Layer w0.203: U1.13 20.13,4.19 NOREF#7.TP3
L_CC: length 33.8
  Top Layer w0.203: 18.57,16.64 v1(18.57,15.49) ; 18.57,16.64 30.69,16.64 31.46,17.41 35.04,17.41 ; 18.57,16.64 17.73,16.64 16.96,17.41 USB4.A5
  Inner2 w0.203: v1(18.57,15.49) 14.3,15.49 13.54,14.73 v1(13.54,11.84)
  Bottom Layer w0.203: R51.2 13.5,11.8 v1(13.54,11.84)
L_D+: length 23
  Top Layer w0.203: USB3.A6 33.97,17.91 33.9,17.98 31.4,17.98 30.43,17.02 17.99,17.02 17.02,17.98 13.93,17.98 13.86,17.91 USB4.A6
L_D-: length 23
  Top Layer w0.203: USB3.A7 33.97,18.41 33.9,18.34 31.25,18.34 30.29,17.37 18.26,17.37 17.3,18.34 13.93,18.34 13.86,18.41 USB4.A7
L_SBU1: length 23.1
  Top Layer w0.203: USB3.A8 31.31,18.91 30.18,17.78 18.49,17.78 17.36,18.91 USB4.A8
LED1: length 4.4
  Top Layer w0.203: U1.18 22.69,2.66 23.95,1.4 LED5.1
LED2: length 2.7
  Top Layer w0.203: U1.17 22.19,1.4 LED6.1
R_CC: length 46.4
  Inner2 w0.203: v1(13.53,7.49) 12.91,8.12 12.91,19.56 13.54,20.19 v1(20.91,20.19)
  Bottom Layer w0.203: R52.2 13.52,7.48 v1(13.53,7.49) ; USB4.B5 19.9,18.91 ; 19.9,18.91 19.9,19.82 20.27,20.19 v1(20.91,20.19) ; 19.9,18.91 USB3.B5
R_D+: length 22.2
  Bottom Layer w0.203: USB4.B6 13.86,18.41 13.93,18.34 33.9,18.34 33.97,18.41 USB3.B6
R_D-: length 22.2
  Bottom Layer w0.203: USB3.B7 33.97,17.91 33.9,17.98 13.93,17.98 13.86,17.91 USB4.B7
R_SBU2: length 22.1
  Bottom Layer w0.203: USB4.B8 35.03,17.41
RX1+: length 22.2
  Bottom Layer w0.203: USB4.B11 13.86,15.91 13.93,15.98 33.9,15.98 33.97,15.91 USB3.B11
RX1-: length 22.2
  Bottom Layer w0.203: USB3.B10 33.97,16.41 33.9,16.34 13.93,16.34 13.86,16.41 USB4.B10
RX2+: length 23
  Top Layer w0.203: USB4.A11 13.86,20.41 13.93,20.34 16.23,20.34 17.2,21.31 31.01,21.31 31.01,21.31 31.98,21.31 32.95,20.34 33.9,20.34 33.97,20.41 USB3.A11
RX2-: length 23
  Top Layer w0.203: USB4.A10 13.86,19.91 13.93,19.98 16.38,19.98 17.35,20.96 30.86,20.96 30.86,20.95 31.84,20.95 32.81,19.98 33.9,19.98 33.97,19.91 USB3.A10
STM32_CC1: length 20.3
  Top Layer w0.203: U1.43 v1(22.69,10.92)
  Inner2 w0.203: v1(22.69,10.92) 22.69,7.88 21.54,6.73 12.91,6.73 11.89,7.75 v1(11.89,10.92)
  Bottom Layer w0.203: v1(11.89,10.92) R51.1
STM32_CC2: length 18.1
  Top Layer w0.203: U1.41 23.7,12.62 v1(23.7,10.92)
  Inner2 w0.203: v1(11.89,6.6) 12.39,6.1 21.8,6.1 23.19,7.49 23.19,10.41 v1(23.7,10.92)
  Bottom Layer w0.203: v1(11.89,6.6) 11.89,6.6 R52.1
SWCLK: length 11.5
  Top Layer w0.203: U1.38 v1(25.19,13.97)
  Inner2 w0.203: H1.3 25.19,20.74 v1(25.19,13.97)
SWDIO: length 10.9
  Top Layer w0.203: v1(25.99,13.97) 25.69,13.67 U1.37
  Inner2 w0.203: v1(25.99,13.97) 25.99,22.48 H1.2
TIM2_CH1: length 2.6
  Top Layer w0.203: U1.8 17.59,7.63 17.1,8.13 NOREF#2.TP1
TX1+: length 23.3
  Top Layer w0.203: USB3.A2 33.97,15.91 33.9,15.98 31.94,15.98 30.56,14.61 17.99,14.61 16.61,15.98 13.93,15.98 13.86,15.91 USB4.A2
TX1-: length 23.3
  Top Layer w0.203: USB3.A3 33.97,16.41 33.9,16.34 31.66,16.34 30.31,14.99 18.24,14.99 16.89,16.34 13.93,16.34 13.86,16.41 USB4.A3
TX2+: length 23
  Bottom Layer w0.203: USB4.B2 13.86,20.41 13.93,20.34 16.23,20.34 17.22,21.34 30.99,21.34 31.01,21.31 31.98,21.31 32.95,20.34 33.9,20.34 33.97,20.41 USB3.B2
TX2-: length 23
  Bottom Layer w0.203: USB3.B3 33.97,19.91 33.9,19.98 32.81,19.98 31.84,20.95 30.86,20.95 30.84,20.98 17.37,20.98 16.38,19.98 13.93,19.98 13.86,19.91 USB4.B3
USART1_RX: length 17.9
  Top Layer w0.203: U1.32 23.84,9.13 v1(23.83,9.14)
  Inner2 w0.203: v1(23.83,9.14) 23.83,7.49 21.92,5.59 17.86,5.59 16.21,3.94 14.81,3.94 14.18,3.3 H6.1
USART1_TX: length 14.8
  Top Layer w0.203: U1.31 24.84,8.63 v1(24.34,8.13)
  Inner2 w0.203: v1(24.34,8.13) 24.34,7.37 22.18,5.21 18.37,5.21 16.72,3.56 H6.2
USB_DM: length 15.4
  Top Layer w0.203: USB1.5 33.24,7.38 33.55,7.69 34.24,7.69 ; 34.24,7.69 34.24,8.13 33.59,8.78 32.79,8.78 arc(32.57,8.87) 32.48,9.08 32.48,9.25 arc(32.23,9.5) 31.98,9.25 31.98,8.51 arc(31.73,8.26) 31.48,8.51 31.48,9.25 arc(31.23,9.5) 30.98,9.25 30.98,8.51 arc(30.73,8.26) 30.48,8.51 30.48,8.63 arc(30.41,8.81) 30.23,8.88 29.68,8.88 28.93,9.63 U1.33 ; 34.24,7.69 34.24,6.44 USB1.7
USB_DP: length 15.4
  Top Layer w0.203: 33.74,5.33 34.5,5.33 34.75,5.59 34.75,6.43 USB1.8 34.75,6.45 34.75,8.76 33.38,10.13 U1.34 ; 33.74,5.33 USB1.6 ; 33.74,5.33 33.74,4.99 33.58,4.83 v1(33.23,4.83)
  Bottom Layer w0.203: R29.1 v1(33.23,4.83)
$1N621:
  vias: v2(27.29,1.4)
$1N623:
  vias: v2(19.98,1.39)
$1N1122: length 2
  Top Layer w0.203: v1(19.89,7.87) 19.63,8.13 U1.7
  Bottom Layer w0.203: v1(19.89,7.87) R2.1
$1N1189: length 2.2
  Top Layer w0.203: U1.45 v1(21.69,11.3)
  Bottom Layer w0.203: R25.2 21.69,10.43 v1(21.69,11.3)
$2N599: length 3.1
  Top Layer w0.203: USB1.10 v1(35.74,5.33)
  Bottom Layer w0.203: R4.1 35,5.08 35.26,5.33 v1(35.74,5.33)
$2N601: length 20.2
  Top Layer w0.4: USB1.13 USB1.13 38.31,1.69 38.31,5.89
  Bottom Layer w0.4: R6.2 37.79,3.93 38.31,4.45 38.31,5.89
$2N604: length 3.4
  Top Layer w0.203: USB1.4 v1(32.74,5.33)
  Bottom Layer w0.203: v1(32.74,5.33) 32.21,5.33 31.45,4.57 R5.1
$2N606: length 2.3
  Bottom Layer w0.203: U2.3 41.41,8.96 R9.1
$3N2025: length 7.4
  Top Layer w0.203: R43.1 12.4,11.81 12.65,11.56 12.65,9.78 12.94,9.5 U12.4 14.02,9.5 15.25,10.73 15.25,11.97 U12.1
$3N2420: length 7.6
  Top Layer w0.203: R46.1 12.4,7.49 12.65,7.24 12.65,5.33 12.94,5.05 U13.4 14.02,5.05 15.38,6.41 U13.1
$5N959: length 4.2
  Bottom Layer w0.203: R10.1 20.07,14.31 C40.1 22.05,13.93 U10.3
$5N960: length 4.2
  Bottom Layer w0.203: R11.1 21.48,12.72 C40.2 22.05,13.28 U10.2
$5N966: length 2.3
  Bottom Layer w0.203: R12.1 29.68,10.67 U10.8
$5N3365: length 1.7
  Top Layer w0.4: R8.1 12.91,23.86 USB4.SH2
$5N3410: length 1.4
  Top Layer w0.4: R36.1 34.73,23.84 v2(34.73,22.48)

## Copper pours and planes (outline as drawn; the poured copper is in the pictures)
GND on Top Layer: 8.33,25 43.33,25 43.33,0 8.33,0
GND on Bottom Layer: 8.33,25 43.33,25 43.33,0 8.33,0
GND on GND: 8.59,24.74 43.08,24.74 43.08,0.26 8.59,0.26
VBUS1 on Top Layer: 12.14,17.27 16.84,17.27 16.84,16.64 12.14,16.64
VBUS1 on Top Layer: 12.14,19.69 16.34,19.69 17.34,20.69 20.29,20.69 20.53,20.45 20.53,18.22 20.29,17.98 18.55,17.98 17.48,19.05 12.14,19.05
VBUS1 on Bottom Layer: 12.14,19.81 16.84,19.81 16.84,19.18 12.14,19.18
VBUS1 on Bottom Layer: 12.14,17.27 16.84,17.27 16.84,16.64 12.14,16.64
VBUS1 on Inner2: 14.05,19.69 16.72,19.69 16.72,16.64 14.05,16.64
VBUS2 on Top Layer: 22.05,20.57 31.9,20.57 32.79,19.69 35.92,19.69 35.92,19.1 31.5,19.1 30.38,17.98 22.23,17.98 21.92,18.29 21.92,20.45
VBUS2 on Top Layer: 31.41,17.14 35.98,17.14 35.98,16.64 31.41,16.64
VBUS2 on Bottom Layer: 31.28,17.27 35.98,17.27 35.98,16.51 31.28,16.51
VBUS2 on Bottom Layer: 31.28,19.77 35.98,19.77 35.98,19.14 31.28,19.14
VBUS2 on Inner2: 31.32,19.81 33.97,19.81 33.97,16.62 31.32,16.62

Small or netless copper shapes (teardrops, artwork), in the pictures only: 94 on Top Layer, 87 on Bottom Layer, 35 on Inner2

## Text on the board
Bottom Silkscreen Layer: 3V3
Top Silkscreen Layer: CUR | vbus | M2 | T2 | D1 | M1 | D2 | RX TX | GND CLK DIO 3V3 | 20250710 V1.3 | PD Sniffer
